# Altium schematic sheet RP2350.SchDoc: RP2040
size B; SheetNumber: 3; SheetTotal: 5
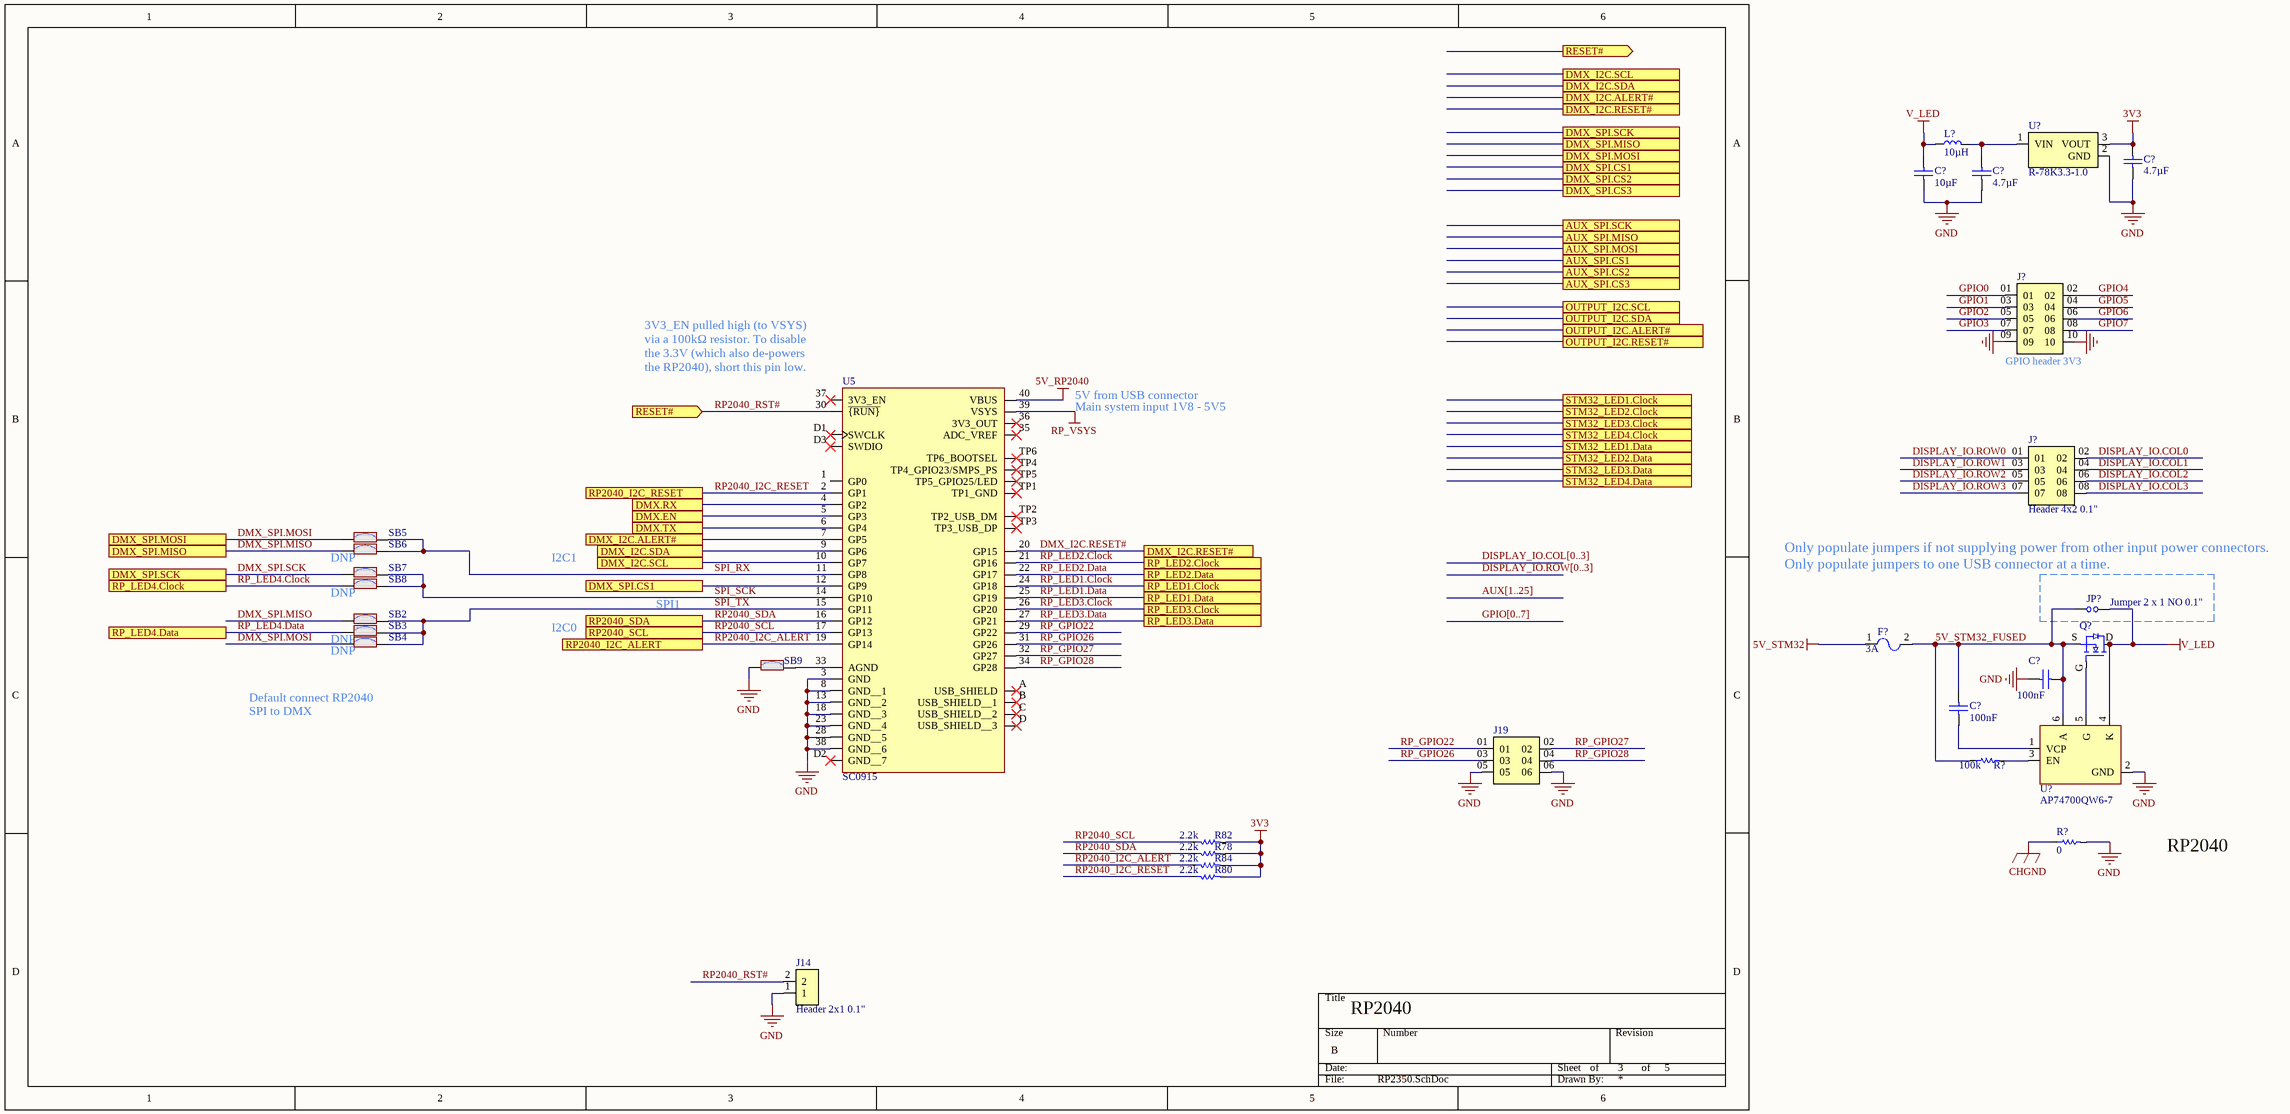
[diagram p0: RP2350.SchDoc]

## Parts
(Parts that share a designator on the sheet are numbered #1, #2 ... from top to bottom, then left to right.)
C?#1  value 4.7µF  [CAPC2012X14N_0805_MED]  (hidden comment: GRM21BR61H475KE51L)
C?#2  value 10µF  [CAPC2012X14N_0805_MED]  (hidden comment: GRM21BR61H106KE43L)
C?#3  value 4.7µF  [CAPC2012X14N_0805_MED]  (hidden comment: GRM21BR61H475KE51L)
C?#4  value 100nF  [CAPC1608X10N_0603_MED]  (hidden comment: CC0603KRX7R0BB104)
C?#5  value 100nF  [CAPC1608X10N_0603_MED]  (hidden comment: CC0603KRX7R0BB104)
F?  Current Rating: 3A  [FUSE4532X1.55N_1812MED]  (hidden comment: 0ZCG0300FF2B)
J14  Header 2x1 0.1"  [FP-M20-9990245-MFG]
J19  Header 3x2 0.1"  [HEADER 3x2 0.1 Through hole]  (value not drawn)
J?#1  Header 5x2 0.1"  [HEADER 5x2 0.1 Through hole]  (value not drawn)
J?#2  Header 4x2 0.1"  [Header 4x2 0.1"]
JP?  Jumper 2 x 1 NO 0.1"  [FP-M20-9990245-MFG]
L?  value 10µH  [FP-SRN5040-MFG]  (hidden comment: SRN5040-100M)
Q?  BUK9880-55A/CUX  [SOT230P700X180-4N]  (value not drawn)
R78  value 2.2k  [RESC1608X06N_0603_MED]  (hidden comment: RC0603FR-072K2L)
R80  value 2.2k  [RESC1608X06N_0603_MED]  (hidden comment: RC0603FR-072K2L)
R82  value 2.2k  [RESC1608X06N_0603_MED]  (hidden comment: RC0603FR-072K2L)
R84  value 2.2k  [RESC1608X06N_0603_MED]  (hidden comment: RC0603FR-072K2L)
R?#1  value 100k  [RESC1608X06N_0603_MED]  (hidden comment: RC0603DR-07100KL)
R?#2  value 0  [RESC1608X06N_0603_MED]  (hidden comment: RC0603FR-070RL)
SB2  SolderBridge0603_On  [SOLDER-BRIDGE_R0603-0R-CLOSEMASK]  (value not drawn)
SB3  SolderBridge0603_On  [SOLDER-BRIDGE_R0603-0R-CLOSEMASK]  (value not drawn)
SB4  SolderBridge0603_On  [SOLDER-BRIDGE_R0603-0R-CLOSEMASK]  (value not drawn)
SB5  SolderBridge0603_On  [SOLDER-BRIDGE_R0603-0R-CLOSEMASK]  (value not drawn)
SB6  SolderBridge0603_On  [SOLDER-BRIDGE_R0603-0R-CLOSEMASK]  (value not drawn)
SB7  SolderBridge0603_On  [SOLDER-BRIDGE_R0603-0R-CLOSEMASK]  (value not drawn)
SB8  SolderBridge0603_On  [SOLDER-BRIDGE_R0603-0R-CLOSEMASK]  (value not drawn)
SB9  SolderBridge0603_On  [SOLDER-BRIDGE_R0603-0R]  (value not drawn)
U5  SC0915  [SC0915-Footprint-NoDEBUG]
U?#1  R-78K3.3-1.0  [R-78K3.3-1.0-Footprint-1]
U?#2  AP74700QW6-7  [SOT95P285X130-6N]

## Ports
AUX_SPI.CS1, AUX_SPI.CS2, AUX_SPI.CS3, AUX_SPI.MISO, AUX_SPI.MOSI, AUX_SPI.SCK, DMX.EN, DMX.RX, DMX.TX, DMX_I2C.ALERT#, DMX_I2C.RESET#, DMX_I2C.SCL, DMX_I2C.SDA, DMX_SPI.CS1, DMX_SPI.CS2, DMX_SPI.CS3, DMX_SPI.MISO, DMX_SPI.MOSI, DMX_SPI.SCK, OUTPUT_I2C.ALERT#, OUTPUT_I2C.RESET#, OUTPUT_I2C.SCL, OUTPUT_I2C.SDA, RESET# (in), RESET# (out), RP2040_I2C_ALERT, RP2040_I2C_RESET, RP2040_SCL, RP2040_SDA, RP_LED1.Clock, RP_LED1.Data, RP_LED2.Clock, RP_LED2.Data, RP_LED3.Clock, RP_LED3.Data, RP_LED4.Clock, RP_LED4.Data, STM32_LED1.Clock, STM32_LED1.Data, STM32_LED2.Clock, STM32_LED2.Data, STM32_LED3.Clock, STM32_LED3.Data, STM32_LED4.Clock, STM32_LED4.Data

## Nets
3V3: C?#1.2 R78.2 R80.2 R82.2 R84.2 U?#1.3(VOUT)
5V_RP2040: U5.40(VBUS)
5V_STM32: F?.1
CHGND: R?#2.1
GND: C?#1.1 C?#2.1 C?#3.1 C?#4.2 J14.1 J19.05 J19.06 J?#1.09 J?#1.10 R?#2.2 SB9.1 U5.3(GND) U5.8(GND__1) U5.13(GND__2) U5.18(GND__3) U5.23(GND__4) U5.28(GND__5) U5.38(GND__6) U?#1.2(GND) U?#2.2(GND)
RP_VSYS: U5.39(VSYS)
V_LED: C?#2.2 JP?.2 L?.1 Q?.D U?#2.4(K)
5V_STM32_FUSED: C?#4.1 C?#5.2 F?.2 JP?.1 Q?.S R?#1.1 U?#2.6(A)
DISPLAY_IO.COL0: J?#2.02
DISPLAY_IO.COL1: J?#2.04
DISPLAY_IO.COL2: J?#2.06
DISPLAY_IO.COL3: J?#2.08
DISPLAY_IO.ROW0: J?#2.01
DISPLAY_IO.ROW1: J?#2.03
DISPLAY_IO.ROW2: J?#2.05
DISPLAY_IO.ROW3: J?#2.07
DMX.EN: U5.5(GP3) ; port DMX.EN
DMX.RX: U5.4(GP2) ; port DMX.RX
DMX.TX: U5.6(GP4) ; port DMX.TX
DMX_I2C.ALERT#: U5.7(GP5) ; port DMX_I2C.ALERT#
DMX_I2C.RESET#: U5.20(GP15) ; port DMX_I2C.RESET#
DMX_I2C.SCL: U5.10(GP7) ; port DMX_I2C.SCL
DMX_I2C.SDA: U5.9(GP6) ; port DMX_I2C.SDA
DMX_SPI.CS1: U5.12(GP9) ; port DMX_SPI.CS1
DMX_SPI.MISO: SB2.1 SB6.1 ; port DMX_SPI.MISO
DMX_SPI.MOSI: SB4.1 SB5.1 ; port DMX_SPI.MOSI
DMX_SPI.SCK: SB7.1 ; port DMX_SPI.SCK
GPIO0: J?#1.01
GPIO1: J?#1.03
GPIO2: J?#1.05
GPIO3: J?#1.07
GPIO4: J?#1.02
GPIO5: J?#1.04
GPIO6: J?#1.06
GPIO7: J?#1.08
RP2040_I2C_ALERT: R84.1 U5.19(GP14) ; port RP2040_I2C_ALERT
RP2040_I2C_RESET: R80.1 U5.2(GP1) ; port RP2040_I2C_RESET
RP2040_RST#: J14.2 U5.30(~{{RUN}}) ; port RESET#
RP2040_SCL: R82.1 U5.17(GP13) ; port RP2040_SCL
RP2040_SDA: R78.1 U5.16(GP12) ; port RP2040_SDA
RP_GPIO22: J19.01 U5.29(GP22)
RP_GPIO26: J19.03 U5.31(GP26)
RP_GPIO27: J19.02 U5.32(GP27)
RP_GPIO28: J19.04 U5.34(GP28)
RP_LED1.Clock: U5.24(GP18) ; port RP_LED1.Clock
RP_LED1.Data: U5.25(GP19) ; port RP_LED1.Data
RP_LED2.Clock: U5.21(GP16) ; port RP_LED2.Clock
RP_LED2.Data: U5.22(GP17) ; port RP_LED2.Data
RP_LED3.Clock: U5.26(GP20) ; port RP_LED3.Clock
RP_LED3.Data: U5.27(GP21) ; port RP_LED3.Data
RP_LED4.Clock: SB8.1 ; port RP_LED4.Clock
RP_LED4.Data: SB3.1 ; port RP_LED4.Data
SPI_RX: SB5.2 SB6.2 U5.11(GP8)
SPI_SCK: SB7.2 SB8.2 U5.14(GP10)
SPI_TX: SB2.2 SB3.2 SB4.2 U5.15(GP11)
NetC?#3_2: C?#3.2 L?.2 U?#1.1(VIN)
NetC?#5_1: C?#5.1 U?#2.1(VCP)
NetQ?_G: Q?.G U?#2.5(G)
NetR?#1_2: R?#1.2 U?#2.3(EN)
NetSB9_2: SB9.2 U5.33(AGND)

Not connected (* = marked no-connect by the designer): U5 1(GP0) 35(ADC_VREF)* 36(3V3_OUT)* 37(3V3_EN)* A(USB_SHIELD)* B(USB_SHIELD__1)* C(USB_SHIELD__2)* D(USB_SHIELD__3)* D1(SWCLK)* D2(GND__7)* D3(SWDIO)* TP1(TP1_GND)* TP2(TP2_USB_DM)* TP3(TP3_USB_DP)* TP4(TP4_GPIO23/SMPS_PS)* TP5(TP5_GPIO25/LED)* TP6(TP6_BOOTSEL)*

## Buses and harness runs
bus AUX[1..25]
bus DISPLAY_IO.COL[0..3]
bus DISPLAY_IO.ROW[0..3]
bus GPIO[0..7]

## Notes on the sheet
- (near J?#1) GPIO header 3V3
- (near U5) 3V3_EN pulled high (to VSYS) via a 100kΩ resistor. To disable the 3.3V (which also de-powers the RP2040), short this pin low.
- 5V from USB connector
- Main system input 1V8 - 5V5
- (near SB6) DNP
- (near SB8) DNP
- I2C1
- SPI1
- Only populate jumpers if not supplying power from other input power connectors.
  Only populate jumpers to one USB connector at a time.
- DNP
- (near SB4) DNP
- I2C0
- Default connect RP2040 SPI to DMX
- of

## Library data of the parts
C?#1 C?#3 = CMP-001-00165-2: Ceramic Capacitor, Multilayer, Ceramic, 50V, 10% +Tol, 10% -Tol, X5R, 15% TC, 4.7uF, Surface Mount, 0805; Min Operating Temperature: -55°C; Max Operating Temperature: 85°C; Voltage Rating: 50V; Mounting Technology: Surface Mount; Tolerance: 10%; Case/Package: 0805; RoHS Compliant: Yes; Capacitor Type: Ceramic; Pins: 2; JLCPN: C162420
C?#2 = CMP-001-00169-2: Ceramic Capacitor, Multilayer, Ceramic, 10uF, 50V, 10%, X6S, 0805; Mounting Technology: Surface Mount; Case/Package: 0805; Tolerance: 10%; RoHS Compliant: Yes; Capacitor Type: Ceramic; Max Operating Temperature: 85°C; Min Operating Temperature: -55°C; Pins: 2; Voltage Rating: 50V; JLCPN: C440198
C?#4 C?#5 = CMP-001-00102-4: Ceramic Capacitor, Multilayer, Ceramic, 100V, 10% +Tol, 10% -Tol, X7R, 15% TC, 0.1uF, Surface Mount, 0603; Max Operating Temperature: 125°C; RoHS Compliant: Yes; Case/Package: 0603; Mounting Technology: Surface Mount; Capacitor Type: Ceramic; Pins: 2; Voltage Rating: 100V; Min Operating Temperature: -55°C; JLCPN: C113803
F? = CMP-005-00018-1: PTC Resettable Fuse, 6V, 3A Surface Mount; Max Operating Temperature: 85°C; Case/Package: 1812; Pins: 2; Mounting Technology: SMT; Min Operating Temperature: -40°C; RoHS Compliant: Yes
J14 = CMP-002-00082-2: Conn Header Vert 2POS 2.54MM; Connector Type: BOARD CONNECTOR; Min Operating Temperature: -40°C; Mounting Technology: Through Hole; Pins: 2; Max Operating Temperature: 105°C; RoHS Compliant: Yes
J19 = CMP-002-00222-3: Board Connector Tall, 6 Contact(s), 2 Row(s), Male, Straight, 0.1 inch Pitch; Max Current Rating: 3A; Pins: 6; Connector Type: Header; Gender: Male; RoHS Compliant: Yes; Mounting Technology: Board
J?#1 = CMP-002-00228-3: Board Connector Tall, 10 Contact(s), 2 Row(s), Male, Straight, 0.1 inch Pitch; Max Current Rating: 3A; Mounting Technology: Board; RoHS Compliant: Yes; Gender: Male; Pins: 10; Connector Type: Header
J?#2 = CMP-002-00227-2: Board Connector, 8 Contact(s), 2 Row(s), Female, 0.1 inch Pitch; Gender: Male; Max Current Rating: 3A; Pins: 8; Max Operating Temperature: 105°C; Connector Type: BOARD CONNECTOR; RoHS Compliant: Yes; Min Operating Temperature: -40°C; Mounting Technology: Board
JP? = CMP-002-00086-5: Connector Type: BOARD CONNECTOR; Pins: 2; Max Operating Temperature: 105°C; RoHS Compliant: Yes; Mounting Technology: Through Hole; Min Operating Temperature: -40°C
L? = CMP-006-00030-2: General Purpose Inductor, 10uH, 20%, 1 Element, Ferrite-Core, SMD, 2020; Self Resonant Frequency: 17MHz; Max Current Rating: 2.1A; Min Operating Temperature: -40°C; Pins: 2; Mounting Technology: SMT; Max Operating Temperature: 125°C; Tolerance: 20%; RoHS Compliant: Yes; JLCPN: C1329529
Q? = CMP-013-00051-4: BUK9880 Series 55 V 7A 73 mOhm N-Channel TrenchMOS Logic Level FET - SC-73; Vgs (Max): 15V; Pins: 4; Max Operating Temperature: 150°C; Case/Package: SOT; Vgs(th) (Max) @ Id: v; Min Operating Temperature: -55°C
R78 R80 R82 R84 = CMP-009-00304-2: Fixed Resistor, Metal Glaze/thick Film, 0.1W, 2200ohm, 75V, 1% +/-Tol, 100ppm/Cel, Surface Mount, 0603; Power: 100mW; Voltage Rating: 50V; Min Operating Temperature: -55°C; Max Operating Temperature: 155°C; Tolerance: 1%; Case/Package: 0603; Pins: 2; Mounting Technology: Surface Mount; RoHS Compliant: Yes; JLCPN: C114662
R?#1 = CMP-009-00328-2: Fixed Resistor, Metal Glaze/thick Film, 0.1W, 100000ohm, 75V, 0.5% +/-Tol, 100ppm/Cel, Surface Mount, 0603; Power: 100mW; Voltage Rating: 50V; RoHS Compliant: Yes; Max Operating Temperature: 155°C; JLCPN: C163504; Case/Package: 0603; Min Operating Temperature: -55°C; Pins: 2; Mounting Technology: Surface Mount; Tolerance: 0.5%
R?#2 = CMP-009-00204-3: RC Series 0603 0.1 W 0 Ohm Jumper Surface Mount Thick Film Chip Resistor; Tolerance: 1%; Voltage Rating: 75V; Power: 100mW; Min Operating Temperature: -55°C; Pins: 2; Case/Package: 0603; Max Operating Temperature: 155°C; RoHS Compliant: Yes; Mounting Technology: Surface Mount; JLCPN: C100044
SB2-SB9 = CMP-128-000020-6: Solder Bridge ON; Internal_Part_Number: MCD-00071; Manufacturer: YAGEO; Part_Type: Mechanical; Manufacturer_Part_Number: RC0603JR-070RL; Provided_By: SUBCO; ECCN_EU: n/a; Package: SB0603; ComponentLink1Description: Datasheet; Source: MB1404.SCHLIB; Status: Released; Design Item ID: SolderBridge0603_On; ComponentLink1URL: http://tunmcdsvn.tun.st.com/Component_Datasheet_Library/Trunk/Resistors/Yageo_Resistor_RC0603-series; ECCN_US: n/a; JLCPN: C100044
U5 = CMP-031-00011-4: RP2040 Pico ARM Cortex-M0+ - Microcontroller IC 32-Bit Dual-Core 133MHz; MF: Raspberry Pi; Case/Package: Pico; Design Item ID: SC0915
U?#1 = CMP-019-00075-1: R-78K-1.0 Series Single Output 3.3 V 1 A Non Isolated DC/DC Converter - SIP-3; Output Current: 1A; Min Supply Voltage: 4.75V; Output Voltage: 3.3V; Max Supply Voltage: 36V; Pins: 3
U?#2 = CMP-004-00052-1: ORController N-Channel Single Automotive AEC-Q100 6-Pin SOT-26 T/R; Min Operating Temperature: -40°C; Max Operating Temperature: 125°C